# EAGLE design M900D (EAGLE 6.6.0)
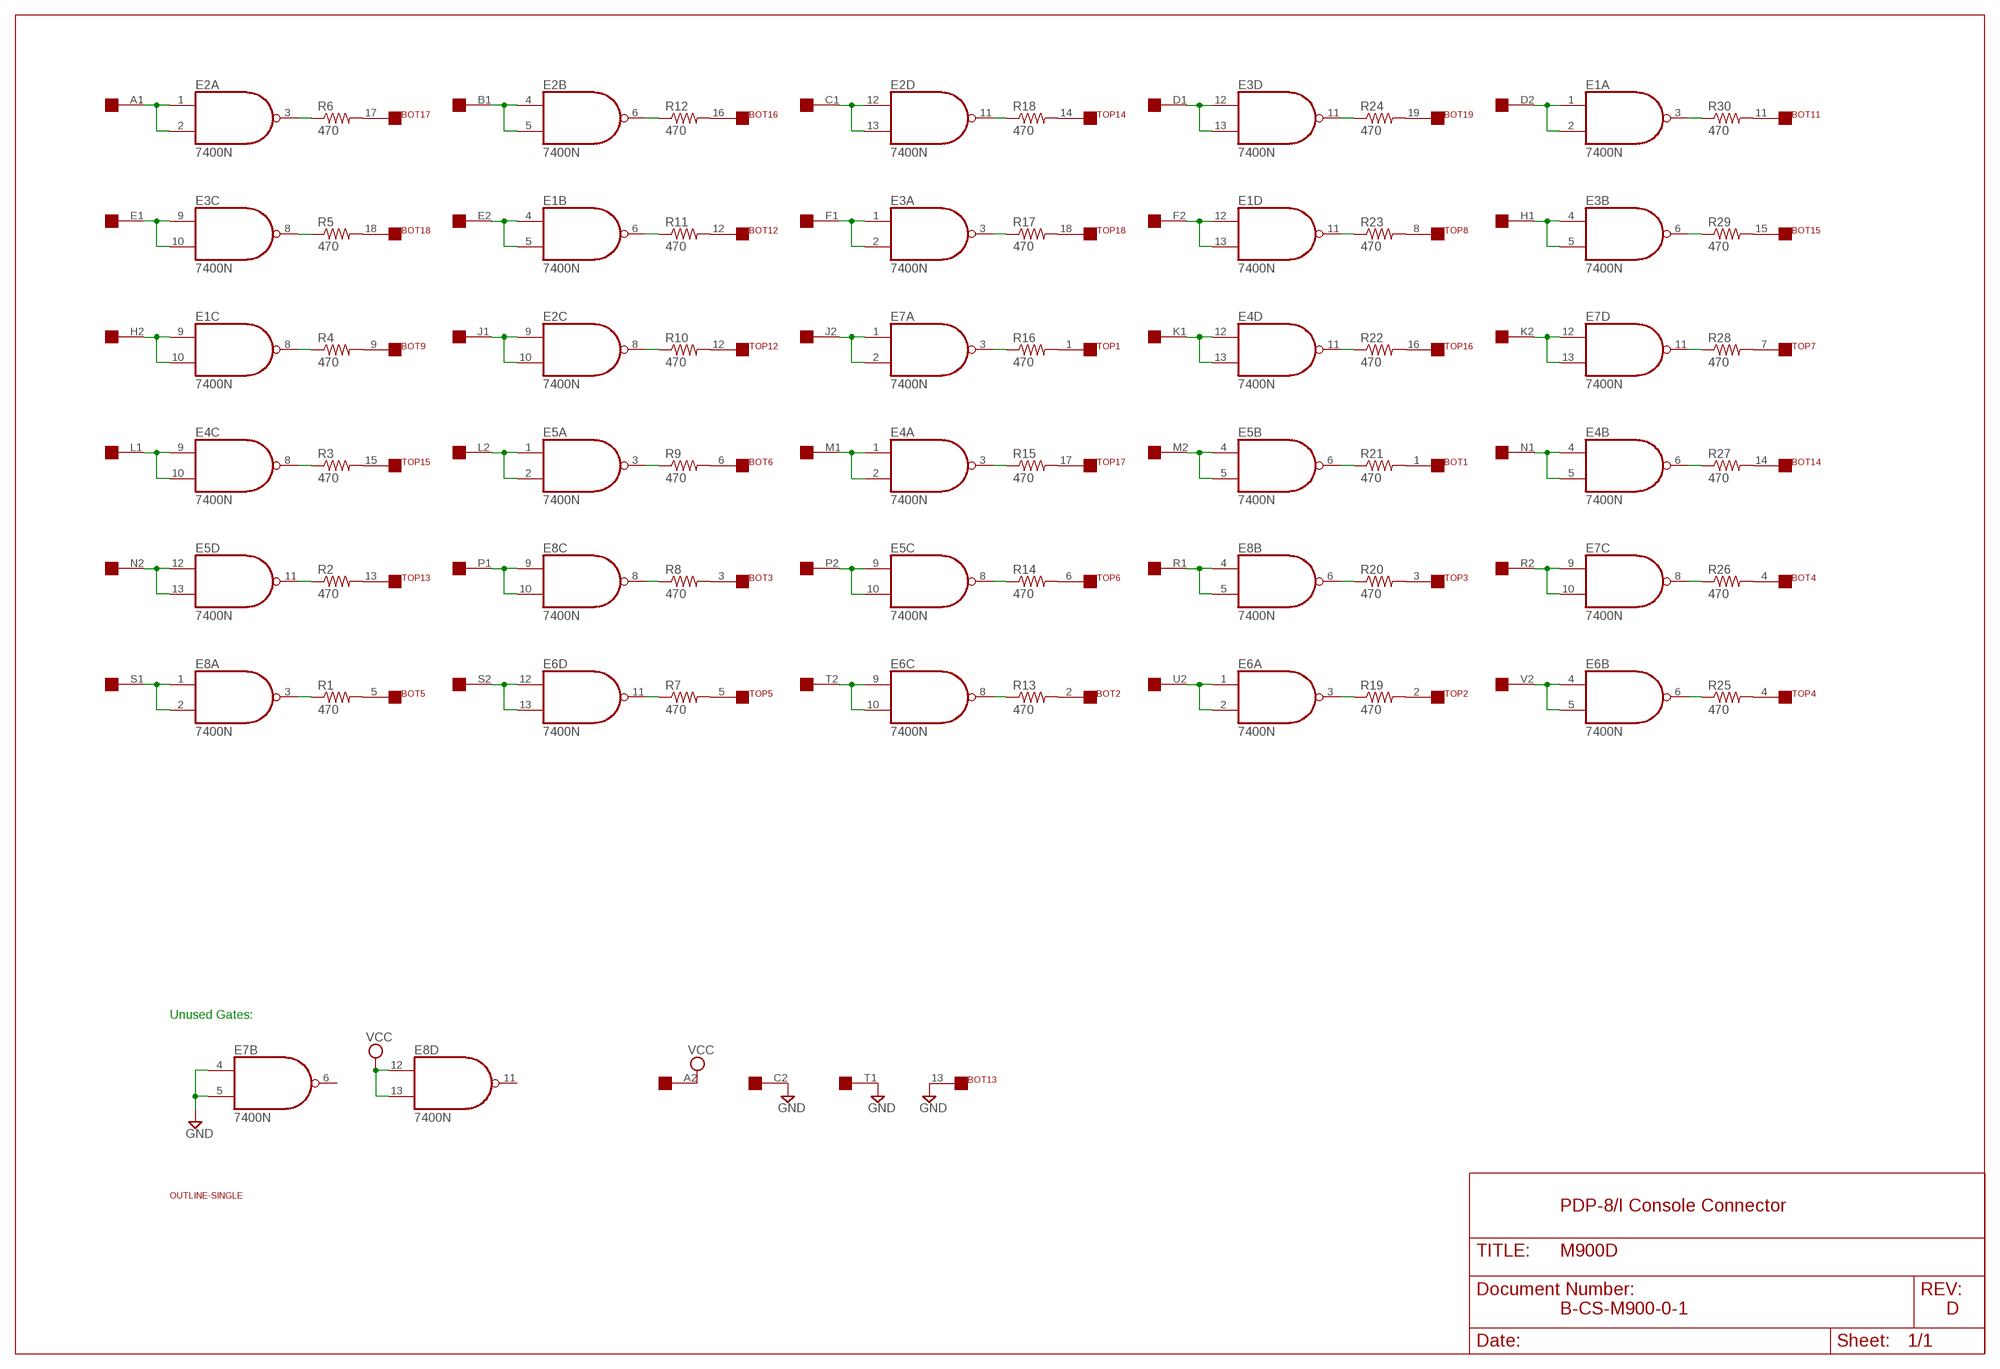
[diagram p0: schematic, sheet 1]

## Parts
BOT  FLEX19  [FLEX19]
E1  7400N  [DIL14]
E2  7400N  [DIL14]
E3  7400N  [DIL14]
E4  7400N  [DIL14]
E5  7400N  [DIL14]
E6  7400N  [DIL14]
E7  7400N  [DIL14]
E8  7400N  [DIL14]
EDGE  SINGLE  [EDGE-CON2]
R1  470  R-US_0207/10  [0207/10]
R2  470  R-US_0207/10  [0207/10]
R3  470  R-US_0207/10  [0207/10]
R4  470  R-US_0207/10  [0207/10]
R5  470  R-US_0207/10  [0207/10]
R6  470  R-US_0207/10  [0207/10]
R7  470  R-US_0207/10  [0207/10]
R8  470  R-US_0207/10  [0207/10]
R9  470  R-US_0207/10  [0207/10]
R10  470  R-US_0207/10  [0207/10]
R11  470  R-US_0207/10  [0207/10]
R12  470  R-US_0207/10  [0207/10]
R13  470  R-US_0207/10  [0207/10]
R14  470  R-US_0207/10  [0207/10]
R15  470  R-US_0207/10  [0207/10]
R16  470  R-US_0207/10  [0207/10]
R17  470  R-US_0207/10  [0207/10]
R18  470  R-US_0207/10  [0207/10]
R19  470  R-US_0207/10  [0207/10]
R20  470  R-US_0207/10  [0207/10]
R21  470  R-US_0207/10  [0207/10]
R22  470  R-US_0207/10  [0207/10]
R23  470  R-US_0207/10  [0207/10]
R24  470  R-US_0207/10  [0207/10]
R25  470  R-US_0207/10  [0207/10]
R26  470  R-US_0207/10  [0207/10]
R27  470  R-US_0207/10  [0207/10]
R28  470  R-US_0207/10  [0207/10]
R29  470  R-US_0207/10  [0207/10]
R30  470  R-US_0207/10  [0207/10]
TOP  FLEX19  [FLEX19]
U$2  OUTLINE-SINGLE  [SINGLE]

## Nets
GND [supply]: BOT.13 E7.4(B:I0) E7.5(B:I1) EDGE.C2 EDGE.T1
N$1: E2.1(A:I0) E2.2(A:I1) EDGE.A1
N$2: E2.3(A:O) R6.1
N$3: E3.8(C:O) R5.1
N$4: E1.8(C:O) R4.1
N$5: E4.8(C:O) R3.1
N$6: E5.11(D:O) R2.1
N$7: E1.9(C:I0) E1.10(C:I1) EDGE.H2
N$8: E8.1(A:I0) E8.2(A:I1) EDGE.S1
N$9: E5.12(D:I0) E5.13(D:I1) EDGE.N2
N$10: E4.9(C:I0) E4.10(C:I1) EDGE.L1
N$11: E3.9(C:I0) E3.10(C:I1) EDGE.E1
N$12: E8.9(C:I0) E8.10(C:I1) EDGE.P1
N$13: E2.4(B:I0) E2.5(B:I1) EDGE.B1
N$14: E1.4(B:I0) E1.5(B:I1) EDGE.E2
N$15: E2.9(C:I0) E2.10(C:I1) EDGE.J1
N$16: E5.1(A:I0) E5.2(A:I1) EDGE.L2
N$17: E6.12(D:I0) E6.13(D:I1) EDGE.S2
N$18: E8.8(C:O) R8.1
N$19: E5.3(A:O) R9.1
N$20: E2.8(C:O) R10.1
N$21: E1.6(B:O) R11.1
N$22: E2.6(B:O) R12.1
N$23: E6.11(D:O) R7.1
N$24: E8.3(A:O) R1.1
N$25: E5.9(C:I0) E5.10(C:I1) EDGE.P2
N$26: E2.12(D:I0) E2.13(D:I1) EDGE.C1
N$27: E3.1(A:I0) E3.2(A:I1) EDGE.F1
N$28: E7.1(A:I0) E7.2(A:I1) EDGE.J2
N$29: E4.1(A:I0) E4.2(A:I1) EDGE.M1
N$30: E6.9(C:I0) E6.10(C:I1) EDGE.T2
N$31: E6.8(C:O) R13.1
N$32: E5.8(C:O) R14.1
N$33: E4.3(A:O) R15.1
N$34: E7.3(A:O) R16.1
N$35: E2.11(D:O) R18.1
N$36: E3.3(A:O) R17.1
N$37: E6.3(A:O) R19.1
N$38: E8.6(B:O) R20.1
N$39: E5.6(B:O) R21.1
N$40: E4.11(D:O) R22.1
N$41: E1.11(D:O) R23.1
N$42: E3.11(D:O) R24.1
N$43: E8.4(B:I0) E8.5(B:I1) EDGE.R1
N$44: E1.12(D:I0) E1.13(D:I1) EDGE.F2
N$45: E4.12(D:I0) E4.13(D:I1) EDGE.K1
N$46: E5.4(B:I0) E5.5(B:I1) EDGE.M2
N$47: E6.1(A:I0) E6.2(A:I1) EDGE.U2
N$48: E7.9(C:I0) E7.10(C:I1) EDGE.R2
N$49: E3.12(D:I0) E3.13(D:I1) EDGE.D1
N$50: E1.1(A:I0) E1.2(A:I1) EDGE.D2
N$51: E3.4(B:I0) E3.5(B:I1) EDGE.H1
N$52: E7.12(D:I0) E7.13(D:I1) EDGE.K2
N$53: E4.4(B:I0) E4.5(B:I1) EDGE.N1
N$54: E6.4(B:I0) E6.5(B:I1) EDGE.V2
N$55: E6.6(B:O) R25.1
N$56: E7.8(C:O) R26.1
N$57: E4.6(B:O) R27.1
N$58: E7.11(D:O) R28.1
N$59: E3.6(B:O) R29.1
N$60: E1.3(A:O) R30.1
N$61: R17.2 TOP.18
N$62: R15.2 TOP.17
N$63: R22.2 TOP.16
N$64: R3.2 TOP.15
N$65: R18.2 TOP.14
N$66: R2.2 TOP.13
N$67: R10.2 TOP.12
N$68: R23.2 TOP.8
N$69: R28.2 TOP.7
N$70: R14.2 TOP.6
N$71: R7.2 TOP.5
N$72: R25.2 TOP.4
N$73: R20.2 TOP.3
N$74: R19.2 TOP.2
N$75: R16.2 TOP.1
N$76: BOT.15 R29.2
N$77: BOT.3 R8.2
N$78: BOT.1 R21.2
N$79: BOT.2 R13.2
N$80: BOT.4 R26.2
N$81: BOT.5 R1.2
N$82: BOT.19 R24.2
N$83: BOT.18 R5.2
N$84: BOT.17 R6.2
N$85: BOT.16 R12.2
N$86: BOT.14 R27.2
N$87: BOT.12 R11.2
N$88: BOT.9 R4.2
N$89: BOT.6 R9.2
N$90: BOT.11 R30.2
VCC [supply]: E8.12(D:I0) E8.13(D:I1) EDGE.A2
Unconnected: BOT.7 BOT.8 BOT.10 E7.6(B:O) E8.11(D:O) EDGE.B2 EDGE.U1 EDGE.V1 TOP.9 TOP.10 TOP.11 TOP.19

## Notes on the sheet
- Unused Gates:
- PDP-8/I Console Connector
- B-CS-M900-0-1 | D

## Power pins joined to a net without a drawn wire
GND: E1.7(P:GND) E2.7(P:GND) E3.7(P:GND) E4.7(P:GND) E5.7(P:GND) E6.7(P:GND) E7.7(P:GND) E8.7(P:GND)
VCC: E1.14(P:VCC) E2.14(P:VCC) E3.14(P:VCC) E4.14(P:VCC) E5.14(P:VCC) E6.14(P:VCC) E7.14(P:VCC) E8.14(P:VCC)

## Library data of the parts
BOT TOP = dec-con:FLEX19: 19 pin Flexprint Connection
E1-E8 = 74xx-us:74*00: Quad 2-input NAND gate
EDGE = dec-con:SINGLE: Single-Height DEC board
R1-R30 = rcl:R-US_: RESISTOR, American symbol
U$2 = dec-con:OUTLINE-*: Board outlines for DEC boards.

## Net classes
1 supply: width 0.813 mm

## Board
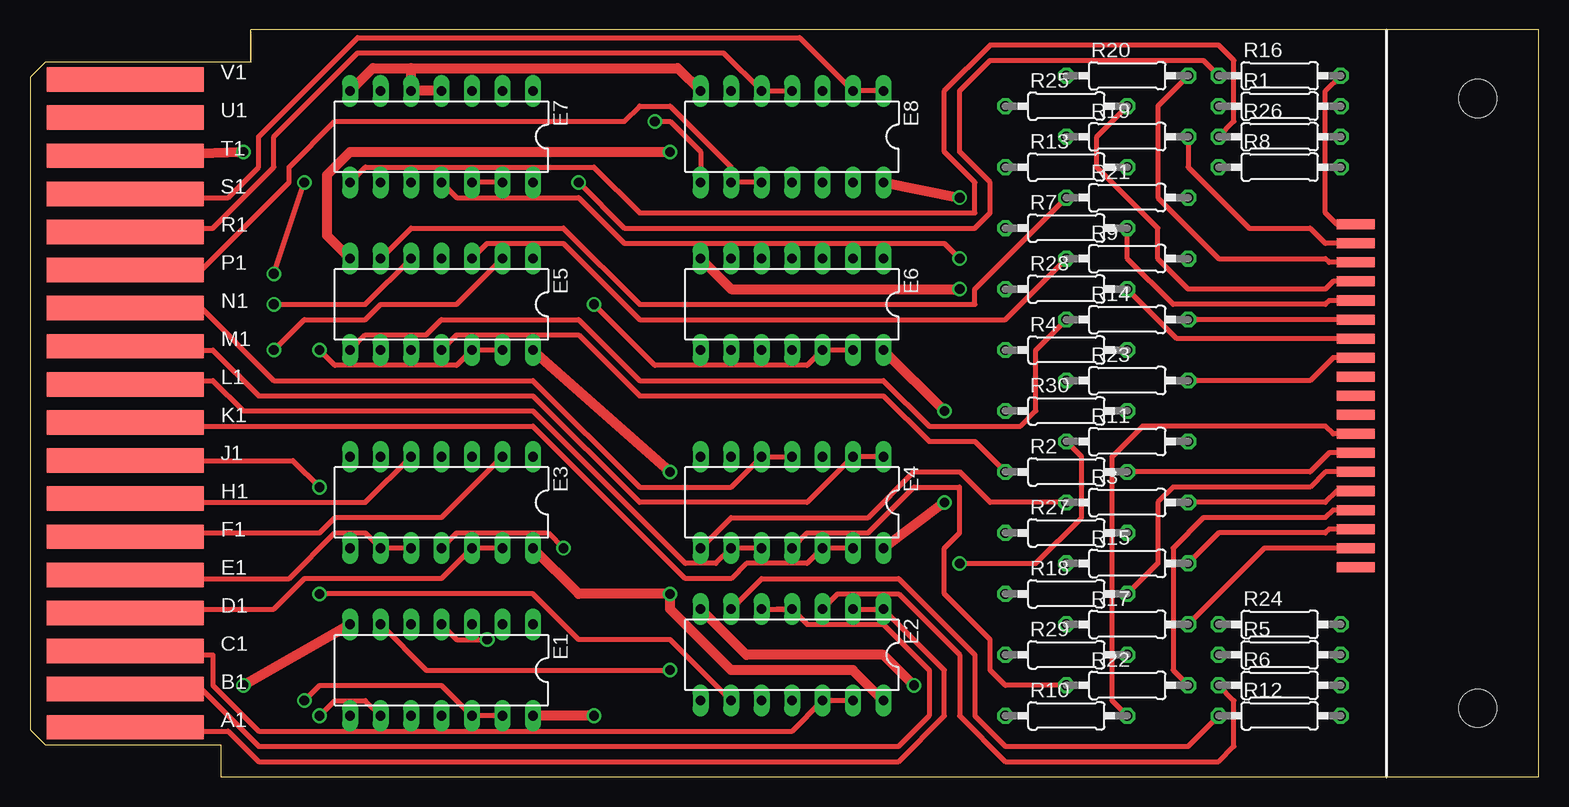
[diagram p1: board, top side]
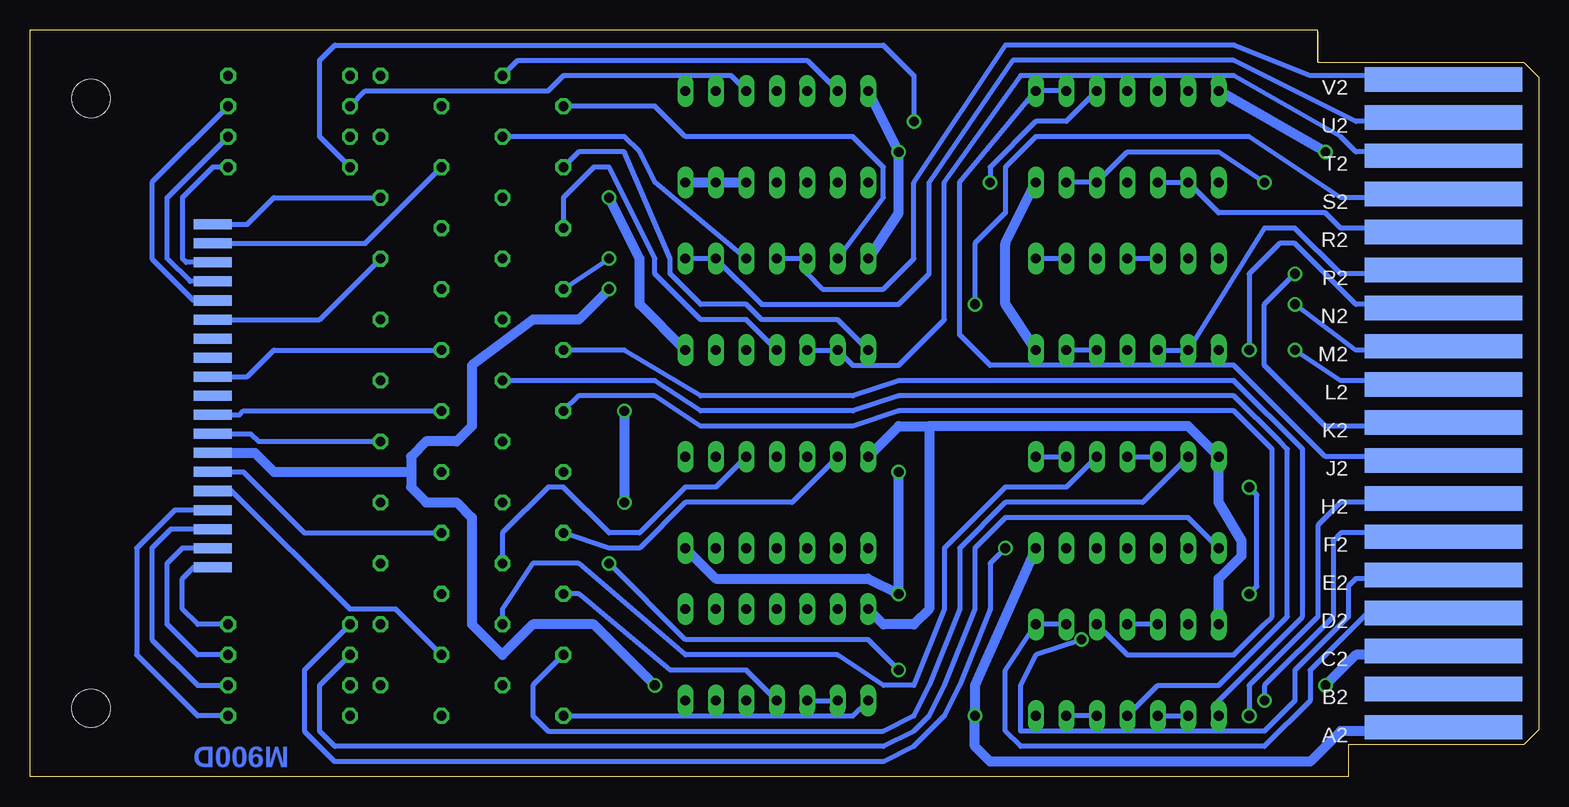
[diagram p2: board, bottom side, seen from below]

Size 125.73 x 62.23 mm. Coordinates in mm from the lower left corner, seen from the top.
Copper layers (1+16): Top 0.035mm / dielectric 1.5mm / Bottom 0.035mm
Design rules "16mils": minimum track width 16mil, minimum drill 32mil, track to track 15mil, track to pad 10mil, pad to pad 10mil, via to via 10mil, smd to smd 10mil, copper to edge 13mil, drill to drill 10mil, minimum pad ring 10mil, minimum via ring 8mil, stop-mask expansion 0mil, vias tented up to drill 0mil, thermal gap 10mil

### Footprints (pad centres in the part's own frame; a part is rotated, then mirrored left to right if it is on the bottom)
FLEX19 = smd 3.175 x 0.838: 1 0,14.287; 2 0,12.7; 3 0,11.113; 4 0,9.525; 5 0,7.938; 6 0,6.35; 7 0,4.763; 8 0,3.175; 9 0,1.587; 10 0,0; 11 0,-1.587; 12 0,-3.175; 13 0,-4.763; 14 0,-6.35; 15 0,-7.938; 16 0,-9.525; 17 0,-11.113; 18 0,-12.7; 19 0,-14.287
DIL14 = drill 0.813 long: 1 -7.62,-3.81; 2 -5.08,-3.81; 3 -2.54,-3.81; 4 0,-3.81; 5 2.54,-3.81; 6 5.08,-3.81; 7 7.62,-3.81; 8 7.62,3.81; 9 5.08,3.81; 10 2.54,3.81; 11 0,3.81; 12 -2.54,3.81; 13 -5.08,3.81; 14 -7.62,3.81
EDGE-CON2 = smd 13.106 x 2.032: A1 7.938,4.128; B1 7.938,7.303; C1 7.938,10.477; D1 7.938,13.652; E1 7.938,16.828; F1 7.938,20.003; H1 7.938,23.177; J1 7.938,26.352; K1 7.938,29.527; L1 7.938,32.703; M1 7.938,35.877; N1 7.938,39.053; P1 7.938,42.227; R1 7.938,45.403; S1 7.938,48.578; T1 7.938,51.752; U1 7.938,54.928; V1 7.938,58.102 | smd 13.106 x 2.032 bottom: A2 7.938,4.128; B2 7.938,7.303; C2 7.938,10.477; D2 7.938,13.652; E2 7.938,16.828; F2 7.938,20.003; H2 7.938,23.177; J2 7.938,26.352; K2 7.938,29.527; L2 7.938,32.703; M2 7.938,35.877; N2 7.938,39.053; P2 7.938,42.227; R2 7.938,45.403; S2 7.938,48.578; T2 7.938,51.752; U2 7.938,54.928; V2 7.938,58.102
0207/10 = drill 0.813 octagon: 1 -5.08,0; 2 5.08,0
SINGLE = hole 3.175: 120.65,56.515; 120.65,5.715

### Placement (x,y rotation side)
BOT  110.49,31.75 0 bottom
E1  34.29,8.89 180 top
E2  63.5,10.16 180 top
E3  34.29,22.86 180 top
E4  63.5,22.86 180 top
E5  34.29,39.37 180 top
E6  63.5,39.37 180 top
E7  34.29,53.34 180 top
E8  63.5,53.34 180 top
EDGE  0,0 0 top
R1  104.14,55.88 0 top
R2  86.36,25.4 0 top
R3  91.44,22.86 0 top
R4  86.36,35.56 0 top
R5  104.14,10.16 0 top
R6  104.14,7.62 0 top
R7  86.36,45.72 0 top
R8  104.14,50.8 0 top
R9  91.44,43.18 0 top
R10  86.36,5.08 0 top
R11  91.44,27.94 0 top
R12  104.14,5.08 0 top
R13  86.36,50.8 0 top
R14  91.44,38.1 0 top
R15  91.44,17.78 0 top
R16  104.14,58.42 0 top
R17  91.44,12.7 0 top
R18  86.36,15.24 0 top
R19  91.44,53.34 0 top
R20  91.44,58.42 0 top
R21  91.44,48.26 0 top
R22  91.44,7.62 0 top
R23  91.44,33.02 0 top
R24  104.14,12.7 0 top
R25  86.36,55.88 0 top
R26  104.14,53.34 0 top
R27  86.36,20.32 0 top
R28  86.36,40.64 0 top
R29  86.36,10.16 0 top
R30  86.36,30.48 0 top
TOP  110.49,31.75 0 top
U$2  0,0 0 top

### Tracks (layer width: path | path; a pad name or v marks a point on that pad's centre or on a via)
GND  (via drill 0.81)
  Top 0.813: v17.78,7.62 E1.7 | EDGE.T1 v17.78,52.07 | v73.66,7.62 71.12,10.16 59.69,10.16 E2.7 | E7.7 28.58,59.05 31.75,59.05 | 31.75,59.05 53.98,59.05 E8.7 | E5.7 24.77,45.09 24.77,50.16 26.67,52.07 v53.34,52.07 | E7.4 E7.5 31.75,59.05 | E6.7 58.42,40.64 v77.47,40.64
  Bottom 0.813: EDGE.C2 8.57,10.48 8.89,10.16 15.24,10.16 v17.78,7.62 | v17.78,52.07 E7.7 | E6.7 53.34,46.99 v53.34,52.07 E8.7 | E1.7 26.67,16.51 24.77,18.41 24.77,19.68 26.67,22.86 E3.7 29.21,29.21 50.8,29.21 | E4.7 53.34,29.21 50.8,29.21 | 50.8,29.21 50.8,13.97 52.07,12.7 54.61,12.7 E2.7 | BOT.13 107,26.99 105.41,25.4 93.98,25.4 | v77.47,40.64 80.01,38.1 83.82,38.1 88.9,34.29 88.9,29.21 90.17,27.94 92.71,27.94 93.98,26.67 93.98,25.4 | 93.98,25.4 93.98,24.13 92.71,22.86 90.17,22.86 88.9,21.59 88.9,12.7 86.36,10.16 83.82,12.7 78.74,12.7 v73.66,7.62
N$1
  Top 0.406: EDGE.A1 8.57,4.13 8.89,3.81 16.51,3.81 19.05,1.27 72.39,1.27 76.2,5.08 76.2,8.89 E2.1 E2.2
N$2
  Top 0.406: E2.3 67.31,15.24 72.39,15.24 77.47,10.16 77.47,5.08 81.28,1.27 99.06,1.27 100.33,2.54 100.33,6.35 R6.1
N$3
  Bottom 0.406: E3.8 29.21,21.59 44.45,21.59 46.99,19.05 46.99,13.97 49.53,7.62 50.8,5.08 52.07,3.81 54.61,2.54 100.33,2.54 101.6,3.81 101.6,7.62 R5.1
N$4
  Bottom 0.406: E1.8 26.67,6.35 19.69,13.34 19.69,27.3 25.4,33.02 53.34,33.02 57.15,31.75 69.85,31.75 76.2,35.56 R4.1
N$5
  Top 0.406: E4.8 58.42,21.59 69.85,21.59 73.66,25.4 77.47,25.4 80.01,22.86 R3.1
N$6
  Top 0.406: E5.11 35.56,36.83 45.72,36.83 50.8,31.75 71.12,31.75 74.93,27.94 78.74,27.94 R2.1
N$7  (via drill 0.81)
  Top 0.406: v24.13,5.08 25.4,6.35 27.94,6.35 E1.9
  Bottom 0.406: EDGE.H2 10.16,22.86 16.51,22.86 18.42,20.95 18.42,13.34 24.13,7.62 v24.13,5.08 | E1.10 E1.9
N$8
  Top 0.406: EDGE.S1 8.57,48.58 8.89,48.26 16.51,48.26 19.05,50.8 19.05,53.34 27.31,61.59 64.14,61.59 E8.2 E8.1
N$9  (via drill 0.81)
  Top 0.406: E5.13 E5.12 35.56,34.29 25.4,34.29 v24.13,35.56
  Bottom 0.406: EDGE.N2 10.16,39.37 15.24,39.37 20.32,44.45 21.59,44.45 24.13,41.91 v24.13,35.56 | E5.12 E5.13
N$10
  Top 0.406: E4.10 E4.9 57.15,17.78 54.61,17.78 41.91,30.48 17.78,30.48 15.24,33.02 10.16,33.02 9.84,32.7 EDGE.L1
N$11
  Top 0.406: E3.10 E3.9 27.94,20.32 25.4,20.32 21.59,16.51 10.16,16.51 9.84,16.83 EDGE.E1
N$12
  Top 0.406: EDGE.P1 8.57,42.23 8.89,41.91 13.97,41.91 21.59,49.53 21.59,50.8 25.4,54.61 49.53,54.61 50.8,55.88 53.34,55.88 58.42,50.8 E8.9 E8.10
N$13
  Top 0.406: EDGE.B1 8.57,7.3 8.89,7.62 13.97,7.62 19.05,2.54 72.39,2.54 74.93,5.08 74.93,8.89 71.12,12.7 64.77,12.7 E2.4 | E2.5 E2.4 | E2.4 62.23,13.97
N$14  (via drill 0.81)
  Top 0.406: E1.4 35.56,11.43 v38.1,11.43
  Bottom 0.406: EDGE.E2 10.16,16.51 15.24,16.51 15.88,15.88 15.88,13.34 20.32,8.89 20.32,6.35 22.86,3.81 43.18,3.81 43.18,7.62 41.91,10.16 v38.1,11.43 | E1.5 E1.4
N$15  (via drill 0.81)
  Top 0.406: EDGE.J1 21.91,26.35 v24.13,24.13 | E2.9 53.34,11.43 45.72,11.43 41.91,15.24 v24.13,15.24
  Bottom 0.406: v24.13,15.24 23.5,15.88 23.5,23.5 v24.13,24.13 | E2.10 E2.9
N$16  (via drill 0.81)
  Top 0.406: v20.32,35.56 22.86,38.1 27.94,38.1 29.21,39.37 35.56,39.37 E5.2
  Bottom 0.406: EDGE.L2 8.89,33.02 16.51,33.02 v20.32,35.56 | E5.2 E5.1
N$17  (via drill 0.81)
  Top 0.406: E6.13 E6.12 64.77,34.29 52.07,34.29 v46.99,39.37
  Bottom 0.406: EDGE.S2 10.16,48.26 16.51,48.26 24.13,53.34 41.91,53.34 44.45,50.8 44.45,46.99 46.99,44.45 v46.99,39.37
N$18  (via drill 0.81)
  Top 0.406: v52.07,54.61 53.34,54.61 55.88,52.07 E8.8
  Bottom 0.406: R8.1 101.6,53.34 101.6,59.69 100.33,60.96 54.61,60.96 52.07,58.42 v52.07,54.61
N$19
  Top 0.406: E5.3 38.1,44.45 44.45,44.45 50.8,38.1 81.28,38.1 R9.1
N$20
  Bottom 0.406: R10.1 57.15,5.08 E2.8
N$21  (via drill 0.81)
  Top 0.406: E1.6 33.02,8.89 v53.34,8.89 | v77.47,17.78 83.82,17.78 87.63,21.59 87.63,26.67 R11.1
  Bottom 0.406: v53.34,8.89 55.88,11.43 71.12,11.43 v77.47,17.78
N$22
  Top 0.406: E2.6 60.96,16.51 72.39,16.51 78.74,10.16 78.74,5.08 81.28,2.54 96.52,2.54 R12.1
N$23
  Bottom 0.406: E6.11 66.04,38.1 69.85,38.1 73.66,41.91 73.66,43.18 77.47,50.8 78.74,50.8 81.28,48.26 R7.1
N$24
  Bottom 0.406: E8.3 67.31,58.42 81.28,58.42 82.55,57.15 97.79,57.15 R1.1
N$25
  Bottom 0.406: EDGE.P2 10.16,41.91 16.51,41.91 20.32,45.72 22.86,45.72 E5.9 E5.10
N$26
  Top 0.406: EDGE.C1 8.57,10.48 8.89,10.16 15.24,10.16 15.24,7.62 19.05,3.81 63.5,3.81 E2.12 E2.13
N$27
  Top 0.406: EDGE.F1 9.84,20 10.16,20.32 24.13,20.32 25.4,21.59 34.29,21.59 E3.2
  Bottom 0.406: E3.1 E3.2
N$28
  Bottom 0.406: EDGE.J2 8.89,26.67 17.78,26.67 25.4,34.29 45.72,34.29 48.26,36.83 48.26,49.53 E7.1 E7.2
N$29
  Top 0.406: EDGE.M1 9.84,35.88 10.16,35.56 15.24,35.56 19.05,31.75 41.91,31.75 50.8,22.86 64.77,22.86 E4.2 E4.1
N$30
  Bottom 0.406: EDGE.T2 10.16,52.07 15.24,52.07 16.51,53.34 25.4,58.42 43.18,58.42 49.53,49.53 49.53,38.1 53.34,34.29 57.15,34.29 E6.9 E6.10
N$31
  Bottom 0.406: E6.8 58.42,38.1 64.77,38.1 66.04,39.37 69.85,39.37 72.39,41.91 72.39,43.18 76.2,52.07 80.01,52.07 R13.1
N$32
  Top 0.406: E5.8 27.94,36.83 33.02,36.83 34.29,38.1 45.72,38.1 50.8,33.02 71.12,33.02 74.93,29.21 82.55,29.21 83.82,30.48 83.82,35.56 R14.1
N$33
  Bottom 0.406: E4.3 68.58,24.13 71.12,24.13 74.93,20.32 77.47,20.32 81.28,24.13 82.55,24.13 86.36,20.32 R15.1
N$34  (via drill 0.81)
  Top 0.406: v45.72,49.53 49.53,45.72 78.74,45.72 80.01,46.99 80.01,49.53 77.47,52.07 77.47,57.15 80.01,59.69 97.79,59.69 R16.1
  Bottom 0.406: E7.3 39.37,54.61 41.91,54.61 45.72,50.8 v45.72,49.53
N$35
  Bottom 0.406: E2.11 66.04,8.89 72.39,8.89 80.01,15.24 R18.1
N$36
  Bottom 0.406: E3.3 39.37,24.13 44.45,24.13 49.53,19.05 49.53,13.97 52.07,7.62 54.61,7.62 58.42,10.16 71.12,10.16 80.01,17.78 83.82,17.78 86.36,13.97 R17.1
N$37
  Bottom 0.406: E6.3 73.66,49.53 74.93,52.07 76.2,53.34 R19.1
N$38
  Bottom 0.406: R20.1 85.09,59.69 60.96,59.69 E8.6
N$39
  Top 0.406: E5.6 31.75,45.72 44.45,45.72 50.8,39.37 78.74,39.37 78.74,40.64 R21.1
N$40
  Top 0.406: E4.11 64.77,20.32 69.85,20.32 73.66,24.13 77.47,24.13 77.47,20.32 76.2,19.05 76.2,15.24 80.01,11.43 80.01,8.89 81.28,7.62 R22.1
N$41
  Bottom 0.406: E1.11 31.75,7.62 26.67,7.62 21.59,12.7 20.96,13.34 20.96,27.3 21.59,27.94 25.4,31.75 53.34,31.75 57.15,30.48 69.85,30.48 73.66,33.02 R23.1
N$42  (via drill 0.81)
  Top 0.406: E3.11 35.56,20.32 43.18,20.32 v44.45,19.05
  Bottom 0.406: R24.1 102.87,8.89 102.87,3.81 100.33,1.27 54.61,1.27 52.07,2.54 49.53,5.08 48.26,7.62 45.72,13.97 45.72,17.78 v44.45,19.05
N$43
  Top 0.406: EDGE.R1 8.57,45.4 8.89,45.72 15.24,45.72 20.32,50.8 20.32,53.34 27.31,60.33 57.79,60.33 E8.5 E8.4
N$44  (via drill 0.81)
  Top 0.406: v22.86,6.35 24.13,7.62 34.29,7.62 E1.12 E1.13
  Bottom 0.406: EDGE.F2 8.89,20.32 16.51,20.32 17.15,19.68 17.15,13.34 22.86,7.62 v22.86,6.35 | E1.12 E1.13
N$45
  Top 0.406: E4.13 E4.12 64.77,17.78 59.69,17.78 58.42,16.51 54.61,16.51 41.91,29.21 10.16,29.21 9.84,29.53 EDGE.K1
N$46  (via drill 0.81)
  Top 0.406: v20.32,39.37 27.94,39.37 E5.5
  Bottom 0.406: EDGE.M2 10.16,35.56 15.24,35.56 v20.32,39.37 | E5.5 E5.4
N$47
  Bottom 0.406: EDGE.U2 10.16,54.61 15.24,54.61 25.4,59.69 43.82,59.69 50.8,49.53 50.8,41.91 53.34,39.37 64.77,39.37 E6.2 E6.1
N$48
  Bottom 0.406: EDGE.R2 8.89,45.72 16.51,45.72 17.78,46.99 26.67,46.99 E7.9 E7.10
N$49
  Top 0.406: E3.13 E3.12 34.29,16.51 22.86,16.51 20.32,13.97 8.89,13.97 8.57,13.65 EDGE.D1
N$50
  Bottom 0.406: EDGE.D2 8.57,13.65 8.89,13.97 13.97,13.97 19.05,8.89 19.05,6.35 22.86,2.54 43.18,2.54 44.45,3.81 44.45,8.89 E1.1 E1.2
N$51
  Top 0.406: EDGE.H1 9.84,23.18 10.16,22.86 27.94,22.86 E3.5
  Bottom 0.406: E3.4 E3.5
N$52  (via drill 0.81)
  Top 0.406: E7.13 E7.12 | v20.32,41.91 v22.86,49.53
  Bottom 0.406: EDGE.K2 10.16,29.21 17.78,29.21 22.86,34.29 22.86,39.37 v20.32,41.91 | v22.86,49.53 26.67,52.07 34.29,52.07 E7.12 E7.13
N$53
  Top 0.406: EDGE.N1 8.57,39.05 8.89,39.37 13.97,39.37 20.32,33.02 41.91,33.02 50.8,24.13 58.42,24.13 E4.5 E4.4
N$54
  Bottom 0.406: EDGE.V2 7.62,58.42 19.05,58.42 25.4,60.96 44.45,60.96 52.07,49.53 52.07,43.18 54.61,40.64 59.69,40.64 60.96,41.91 E6.5 E6.4
N$55
  Bottom 0.406: E6.6 54.61,48.26 54.61,50.8 57.15,53.34 71.12,53.34 73.66,55.88 R25.1
N$56
  Top 0.406: E7.8 27.94,50.8 46.99,50.8 50.8,46.99 78.74,46.99 78.74,49.53 76.2,52.07 76.2,57.15 80.01,60.96 99.06,60.96 100.33,59.69 100.33,54.61 R26.1
N$57
  Bottom 0.406: E4.6 62.23,22.86 71.12,22.86 74.93,19.05 77.47,19.05 R27.1
N$58  (via drill 0.81)
  Top 0.406: E7.11 35.56,48.26 45.72,48.26 49.53,44.45 76.2,44.45 v77.47,43.18
  Bottom 0.406: R28.1 v77.47,43.18
N$59
  Bottom 0.406: R29.1 83.82,7.62 83.82,5.08 82.55,3.81 54.61,3.81 52.07,5.08 50.8,7.62 48.26,13.97 48.26,19.05 44.45,22.86 33.02,22.86 E3.6
N$60
  Bottom 0.406: E1.3 34.29,10.16 25.4,10.16 22.86,12.7 22.23,13.34 22.23,27.3 22.86,27.94 25.4,30.48 53.34,30.48 57.15,29.21 69.85,29.21 73.66,31.75 80.01,31.75 R30.1
N$61
  Top 0.406: TOP.18 102.87,19.05 R17.2
N$62
  Top 0.406: TOP.17 108.27,20.64 107.95,20.32 99.06,20.32 R15.2
N$63
  Top 0.406: TOP.16 108.59,22.23 107.95,21.59 97.79,21.59 95.25,19.05 95.25,8.89 R22.2
N$64
  Top 0.406: TOP.15 108.9,23.81 107.95,22.86 R3.2
N$65
  Top 0.406: TOP.14 107.95,25.4 106.68,24.13 95.25,24.13 93.98,22.86 93.98,17.78 R18.2
N$66
  Top 0.406: TOP.13 108.27,26.99 106.68,25.4 R2.2
N$67
  Top 0.406: TOP.12 108.59,28.57 107.95,29.21 92.71,29.21 90.17,26.67 90.17,6.35 R10.2
N$68
  Top 0.406: TOP.8 108.59,34.92 106.68,33.02 R23.2
N$69
  Top 0.406: TOP.7 95.57,36.51 R28.2
N$70
  Top 0.406: TOP.6 R14.2
N$71
  Top 0.406: R7.2 91.44,43.18 95.25,39.37 107.95,39.37 108.27,39.69 TOP.5
N$72
  Top 0.406: TOP.4 108.59,41.27 107.95,40.64 96.52,40.64 93.98,43.18 93.98,45.72 88.9,50.8 88.9,53.34 R25.2
N$73
  Top 0.406: TOP.3 108.27,42.86 107.95,43.18 99.06,43.18 93.98,48.26 93.98,55.88 R20.2
N$74
  Top 0.406: TOP.2 107.95,44.45 106.68,45.72 101.6,45.72 96.52,50.8 R19.2
N$75
  Top 0.406: TOP.1 108.9,46.04 107.95,46.99 107.95,57.15 R16.2
N$76
  Bottom 0.406: R29.2 95.25,13.97 99.06,13.97 108.9,23.81 BOT.15
N$77
  Bottom 0.406: R8.2 110.49,50.8 113.03,48.26 113.03,43.18 112.71,42.86 BOT.3
N$78
  Bottom 0.406: BOT.1 107.63,46.04 105.41,48.26 R21.2
N$79
  Bottom 0.406: BOT.2 97.79,44.45 R13.2
N$80
  Bottom 0.406: BOT.4 112.4,41.27 114.3,43.18 114.3,48.26 R26.2
N$81
  Bottom 0.406: R1.2 115.57,49.53 115.57,43.18 112.08,39.69 BOT.5
N$82
  Bottom 0.406: R24.2 111.76,12.7 113.03,13.97 113.03,16.51 112.08,17.46 BOT.19
N$83
  Bottom 0.406: R5.2 111.76,10.16 114.3,12.7 114.3,17.78 113.03,19.05 BOT.18
N$84
  Bottom 0.406: BOT.17 113.98,20.64 115.57,19.05 115.57,11.43 111.76,7.62 R6.2
N$85
  Bottom 0.406: R12.2 111.76,5.08 116.84,10.16 116.84,19.05 113.67,22.23 BOT.16
N$86
  Bottom 0.406: BOT.14 107.95,25.4 102.87,20.32 R27.2
N$87
  Bottom 0.406: BOT.12 107.32,28.57 106.68,27.94 R11.2
N$88
  Bottom 0.406: BOT.9 107.63,33.34 105.41,35.56 R4.2
N$89
  Bottom 0.406: BOT.6 101.6,38.1 R9.2
N$90
  Bottom 0.406: BOT.11 108.27,30.16 107.95,30.48 R30.2
VCC  (via drill 0.81)
  Top 0.813: v46.99,5.08 E1.14 | E3.14 45.72,15.24 v53.34,15.24 53.34,13.97 58.42,8.89 68.58,8.89 E2.14 | v53.34,25.4 E5.14 | E8.14 v77.47,48.26 | E6.14 v76.2,30.48 | E4.14 v76.2,22.86
  Bottom 0.813: EDGE.A2 8.57,4.13 8.89,3.81 16.51,3.81 19.05,1.27 45.72,1.27 46.99,2.54 v46.99,5.08 46.99,7.62 E3.14 | E5.14 44.45,39.37 44.45,44.45 E7.14 | E4.14 68.58,16.51 55.88,16.51 v53.34,15.24 v53.34,25.4 | E6.14 74.93,39.37 74.93,43.18 v77.47,48.26 | E8.12 E8.13 E8.14 | v76.2,30.48 v76.2,22.86

### Text on the board
Bottom: M900D